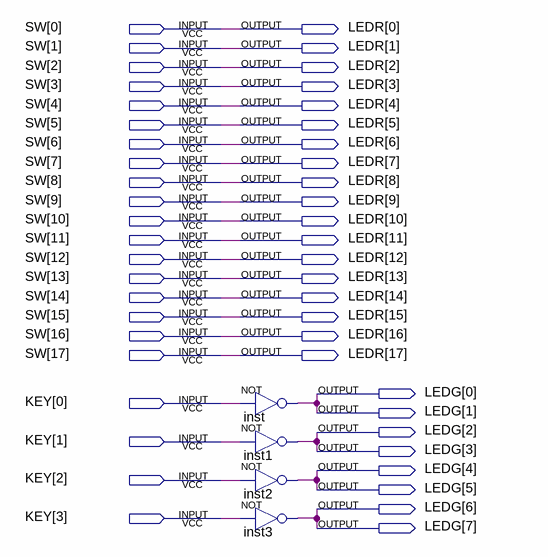
[diagram p0: schematic sheet]
// Quartus schematic zkouska_ledek_a_tlacitek.bdf as structural Verilog: 4 symbols, 48 pins
module zkouska_ledek_a_tlacitek (
  input  [17:0] SW,
  input  [3:0] KEY,
  output [17:0] LEDR,
  output [7:0] LEDG
);

  not inst (LEDG[1], KEY[0]);
  not inst1 (LEDG[3], KEY[1]);
  not inst2 (LEDG[5], KEY[2]);
  not inst3 (LEDG[7], KEY[3]);

  assign {LEDG[6], LEDG[4], LEDG[2], LEDG[0]} = {LEDG[7], LEDG[5], LEDG[3], LEDG[1]};
  assign LEDR = SW;
endmodule
